# EAGLE design ranback_bottom (EAGLE 9.6.2)
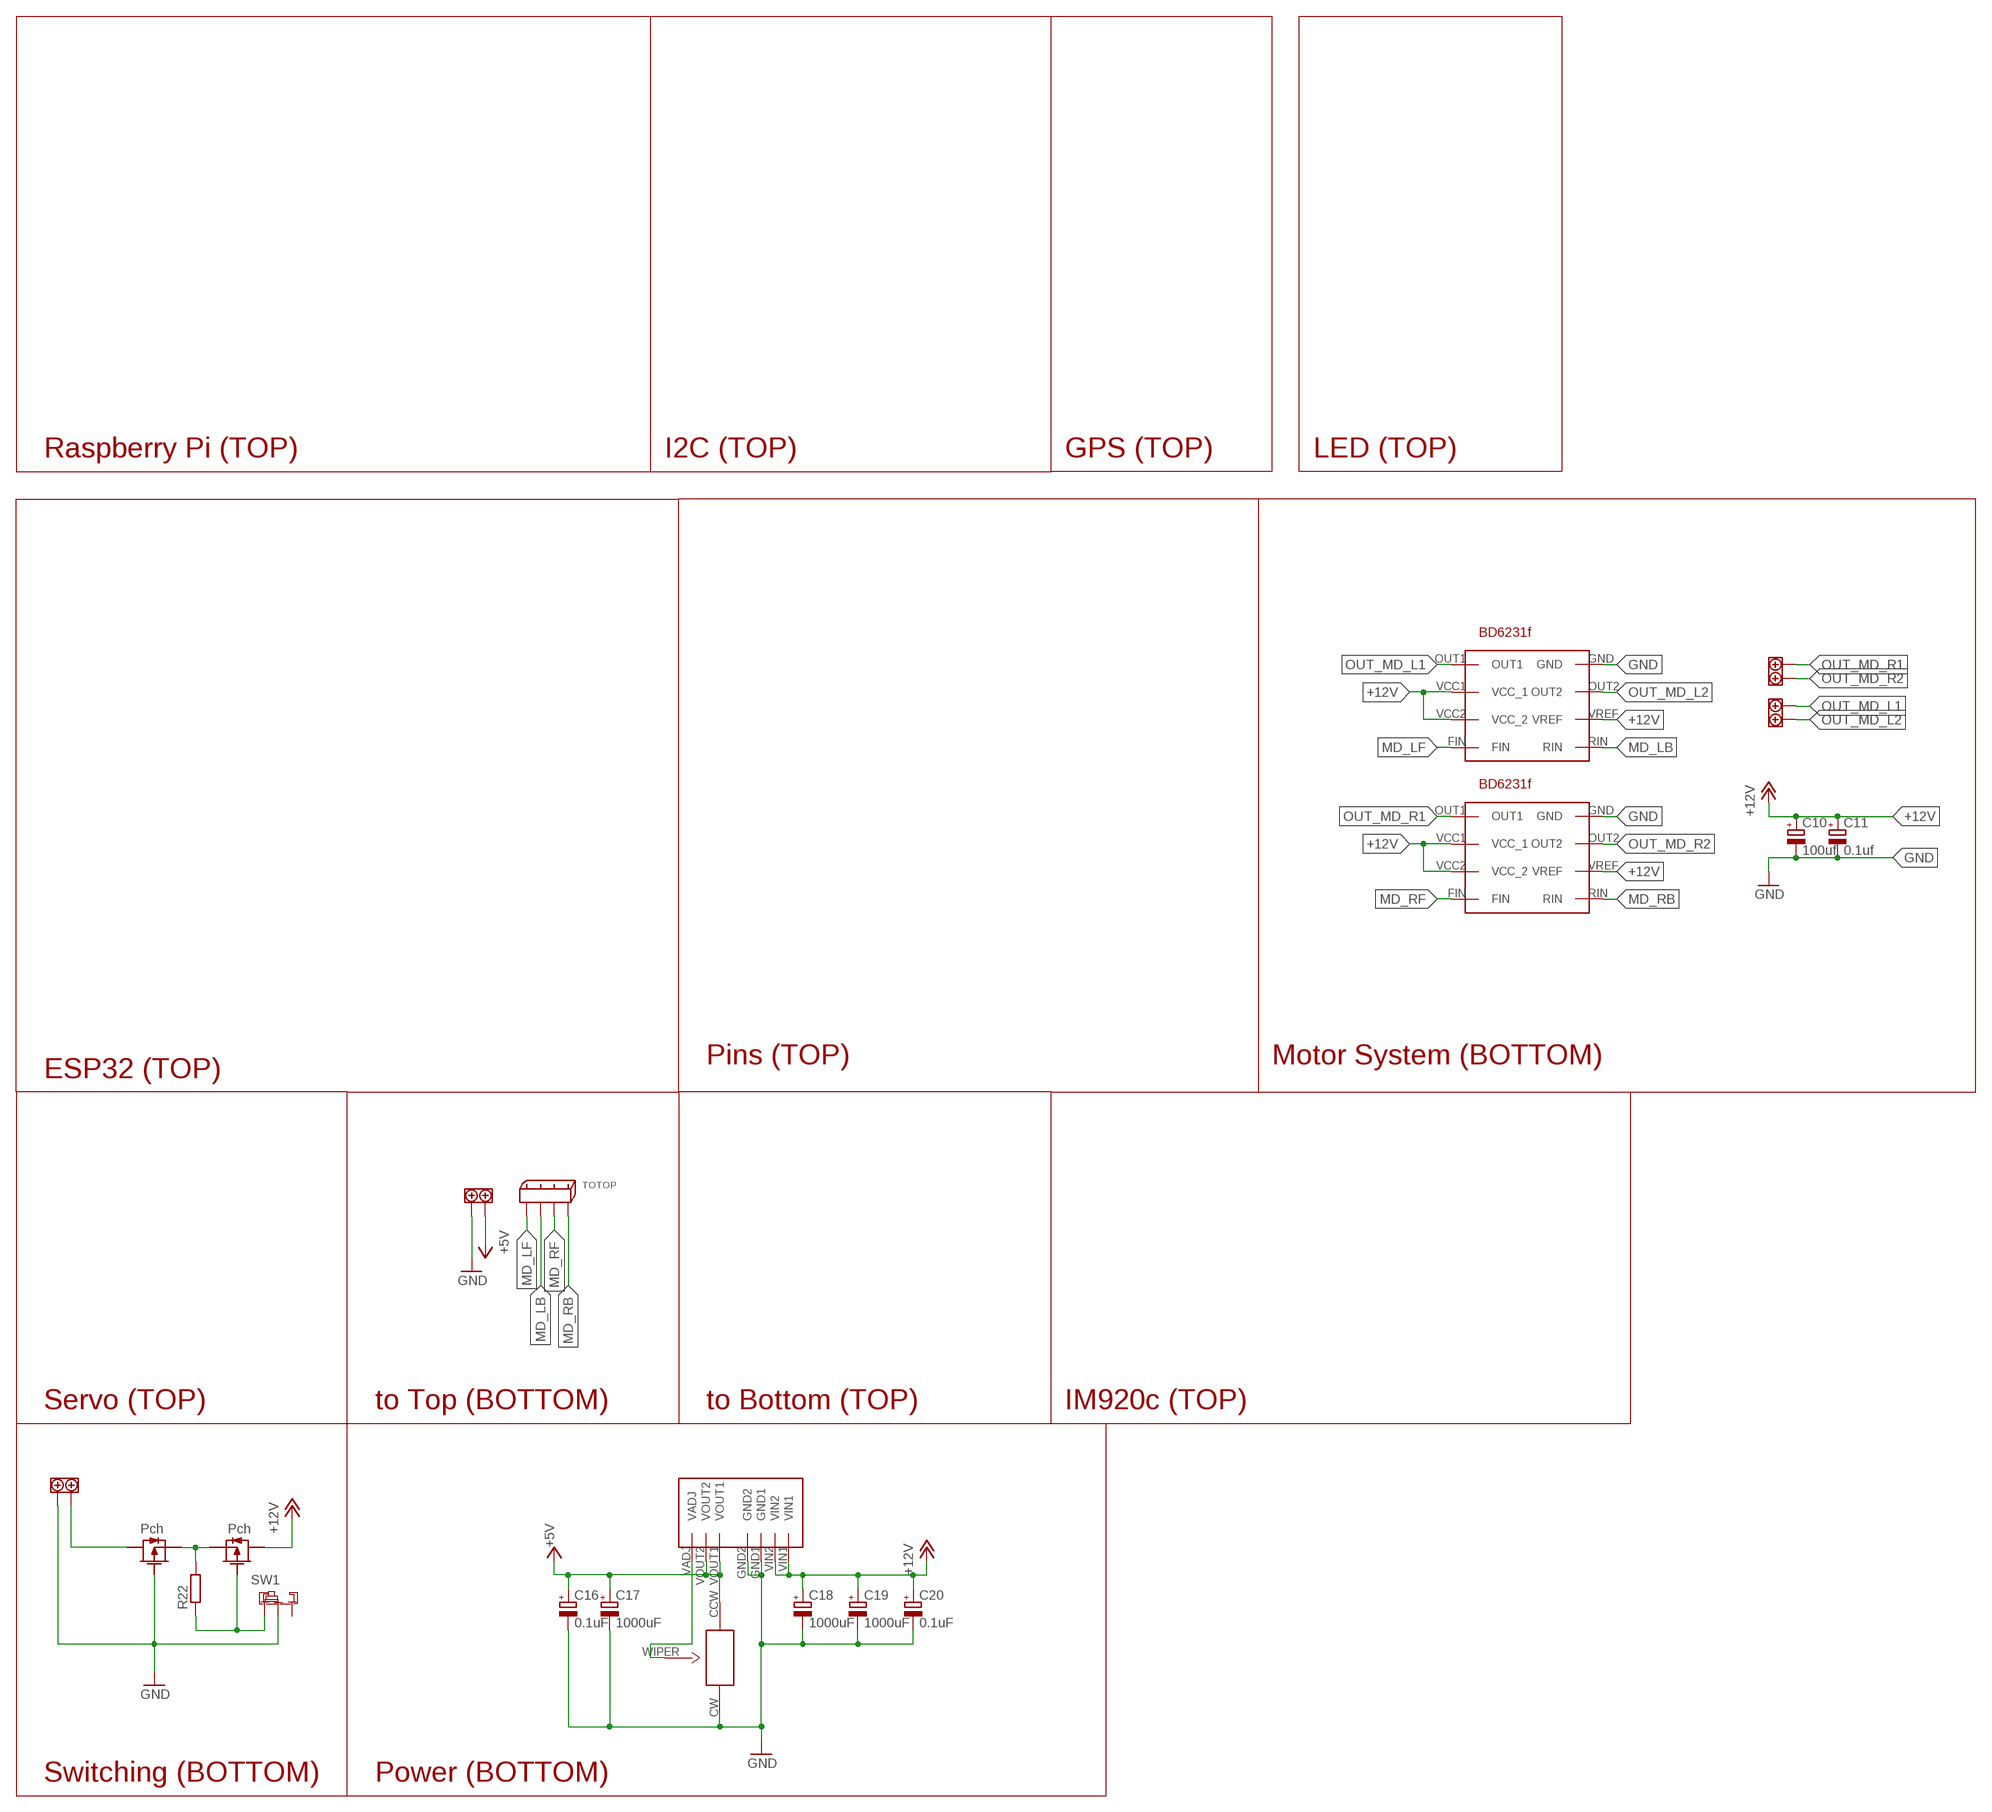
[diagram p0: schematic, sheet 1]

## Parts
100KR1  100kR  3362P  [3362P]
C10  100uf  CPOL-EUE2.5-7  [E2,5-7]
C11  0.1uf  CPOL-EUE2.5-7  [E2,5-7]
C16  0.1uF  CPOL-EUE2.5-7  [E2,5-7]
C17  1000uF  CPOL-EUE5-10.5  [E5-10,5]
C18  1000uF  CPOL-EUE5-10.5  [E5-10,5]
C19  1000uF  CPOL-EUE5-10.5  [E5-10,5]
C20  0.1uF  CPOL-EUE2.5-7  [E2,5-7]
MD_L  BD6231F  [BD6231F]
MD_R  BD6231F  [BD6231F]
R22  R-EU_0207/10  [0207/10]
SW1  SRIDE_SWITCH  [SRIDE_SWITCH]
TM1  TERMINAL_SLOPED_2PIN  [TERMINAL_SLOPED_2PIN]
TM2  TERMINAL_SLOPED_2PIN  [TERMINAL_SLOPED_2PIN]
TM3  TERMINAL_SLOPED_2PIN  [TERMINAL_SLOPED_2PIN]
TM4  TERMINAL_SLOPED_2PIN  [TERMINAL_SLOPED_2PIN]
TOTOP  2.5_MINI-SPOX_4PIN  [2.5_MINI-SPOX_4PIN]
U$7  2SJ681-PCH  [2SJ681]
U$8  5V3A_KIC-053  [5V3A_KIC-053]
U$10  2SJ681-PCH  [2SJ681]

## Nets
+5V: 100KR1.CCW C16.+ C17.+ TM4.1 U$8.VOUT1 U$8.VOUT2
+12V: C10.+ C11.+ C18.+ C19.+ C20.+ MD_L.VCC1(VCC_1) MD_L.VCC2(VCC_2) MD_L.VREF MD_R.VCC1(VCC_1) MD_R.VCC2(VCC_2) MD_R.VREF U$8.VIN1 U$8.VIN2 U$10.DRAIN
A7_1: R22.2 U$7.SOURCE U$10.SOURCE
GND [GND_+12V]: 100KR1.CW C10.- C11.- C16.- C17.- C18.- C19.- C20.- MD_L.GND MD_R.GND SW1.LR TM3.2 TM4.2 U$7.GATE U$8.GND1 U$8.GND2
MD_LB: MD_L.RIN TOTOP.P$2
MD_LF: MD_L.FIN TOTOP.P$1
MD_RB: MD_R.RIN TOTOP.P$4
MD_RF: MD_R.FIN TOTOP.P$3
N$9: TM3.1 U$7.DRAIN
N$18: 100KR1.WIPER U$8.VADJ
N$20: R22.1 SW1.L U$10.GATE
OUT_MD_L1 [GND_+12V]: MD_L.OUT1 TM2.1
OUT_MD_L2 [GND_+12V]: MD_L.OUT2 TM2.2
OUT_MD_R1 [GND_+12V]: MD_R.OUT1 TM1.1
OUT_MD_R2 [GND_+12V]: MD_R.OUT2 TM1.2
Unconnected: SW1.R

## Notes on the sheet
- Raspberry Pi (TOP) | I2C (TOP) | GPS (TOP) | LED (TOP)
- Pins (TOP) | Motor System (BOTTOM)
- ESP32 (TOP)
- Servo (TOP) | to Top (BOTTOM) | to Bottom (TOP) | IM920c (TOP)
- Switching (BOTTOM) | Power (BOTTOM)

## Library data of the parts
100KR1 = TRIM_register:3362P
C10 C11 C16-C20 = rcl:CPOL-EU: POLARIZED CAPACITOR, European symbol; SPICEPREFIX: C
MD_L MD_R = Motor Driver:BD6231F
R22 = rcl:R-EU_: RESISTOR, European symbol; SPICEPREFIX: R
SW1 = Switches:SRIDE_SWITCH
TM1-TM4 = TerminalBrock:TERMINAL_SLOPED_2PIN
TOTOP = Connector:2.5_MINI-SPOX_4PIN
U$7 U$10 = mosfet:2SJ681-PCH
U$8 = DC-DC:5V3A_KIC-053

## Net classes
1 esp: width 0.254 mm, drill 0.127 mm, clearance 0.025 mm
2 GND_+12V: width 0.152 mm

## Board
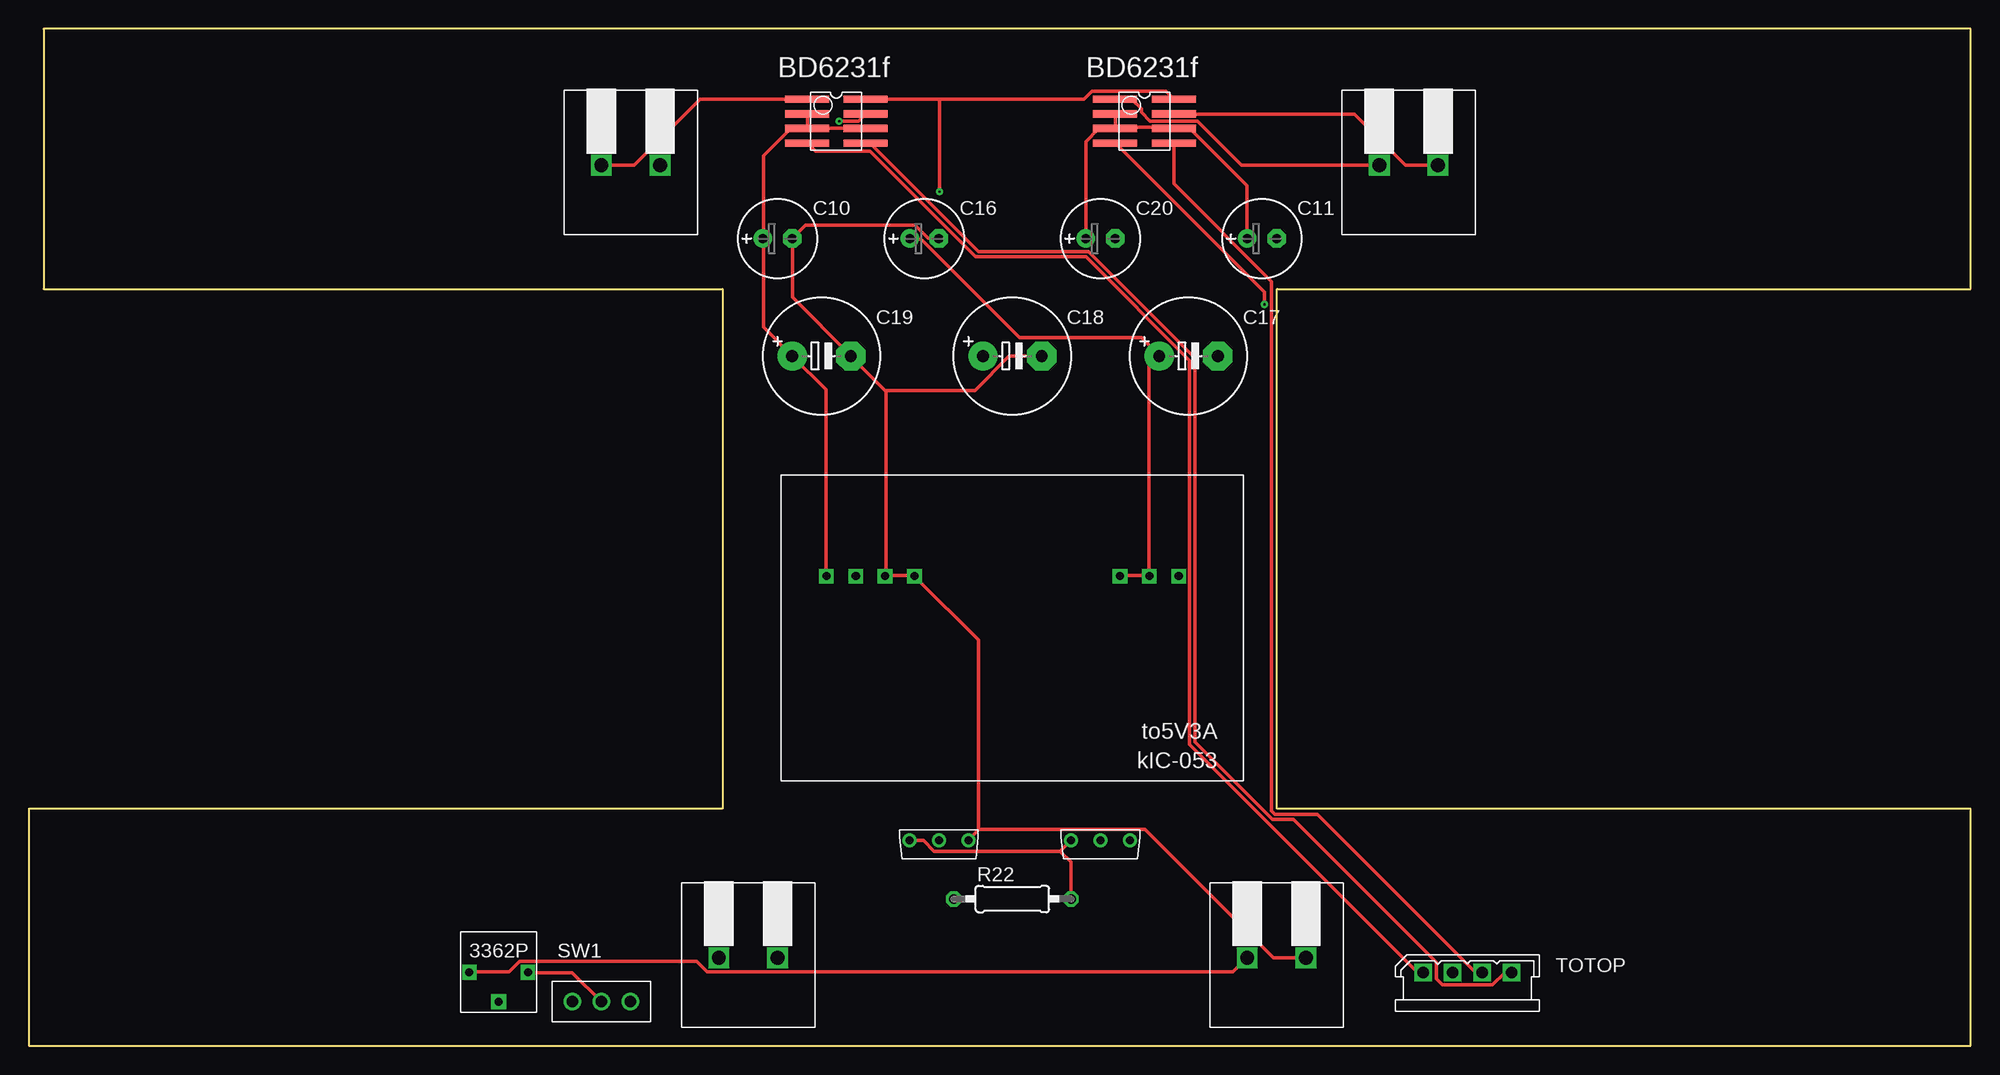
[diagram p1: board, top side]
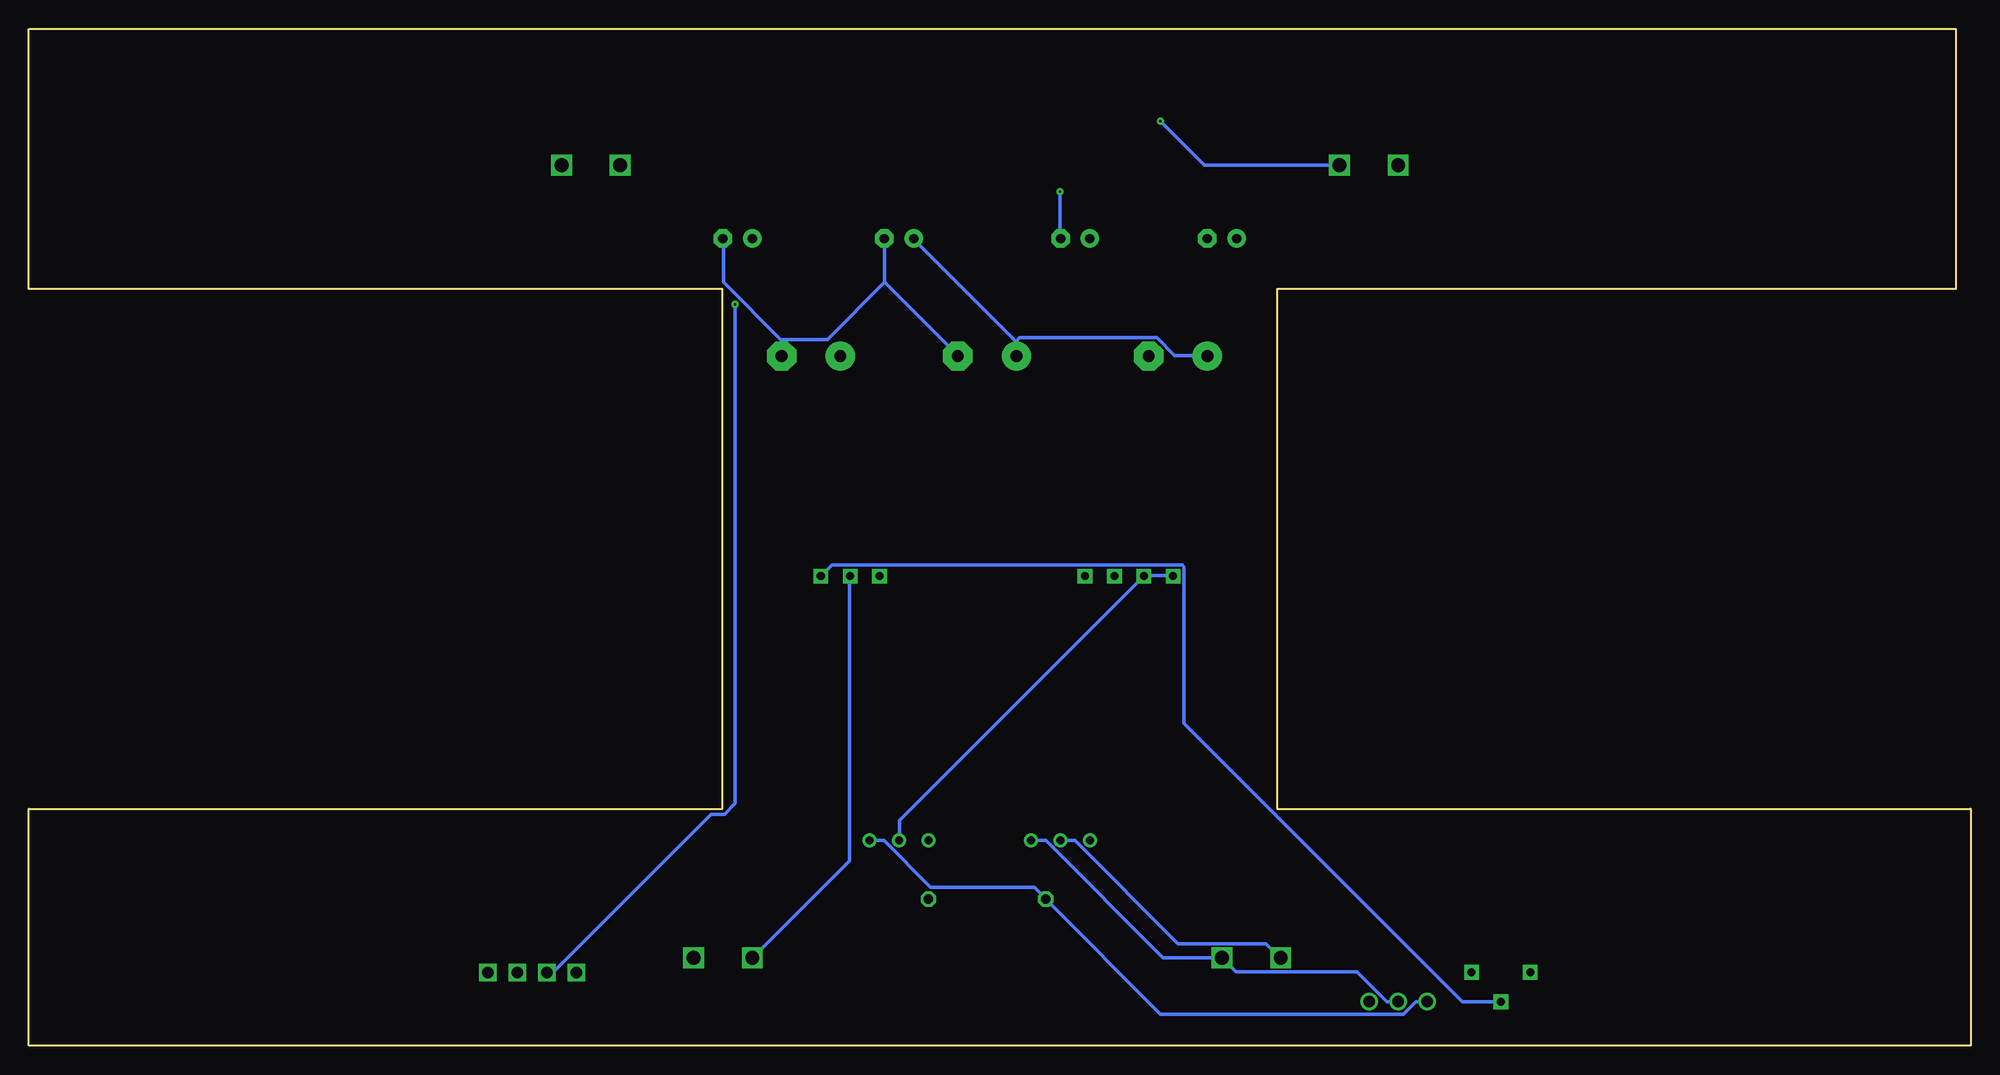
[diagram p2: board, bottom side, seen from below]

Size 168 x 88 mm. Coordinates in mm from the lower left corner, seen from the top.
Outline: 0,0 168,0 168,20.5 108,20.5 108,65.5 168,65.5 168,88 1.27,88 1.27,65.5 60,65.5 60,20.5 0,20.5 0,0
Copper layers (1*16): Top 0.035mm / dielectric 1.5mm / Bottom 0.035mm
Design rules "PCBGoGo": minimum track width 6mil, minimum drill 0.2mm, track to track 6mil, track to pad 6mil, pad to pad 6mil, via to via 6mil, smd to smd 6mil, copper to edge 0.2mm, drill to drill 6mil, minimum pad ring 10mil, minimum via ring 8mil, stop-mask expansion 4mil, vias tented up to drill 0mil, thermal gap 10mil

### Footprints (pad centres in the part's own frame; a part is rotated, then mirrored left to right if it is on the bottom)
3362P = drill 0.7 pad 1.27 square: CCW -2.54,2.54; CW 2.54,2.54; WIPER 0,0
E2,5-7 = drill 0.813 pad 1.6: + -1.27,0 | drill 0.813 pad 1.6 octagon: - 1.27,0
E5-10,5 = drill 1.016 pad 2.54: + -2.54,0 | drill 1.016 pad 2.54 octagon: - 2.54,0
BD6231F = smd 3.81 x 0.635: FIN -2.54,-1.905; GND 2.54,1.905; OUT1 -2.54,1.905; OUT2 2.54,0.635; RIN 2.54,-1.905; VCC1 -2.54,0.635; VCC2 -2.54,-0.635; VREF 2.54,-0.635
0207/10 = drill 0.813 octagon: 1 -5.08,0; 2 5.08,0
SRIDE_SWITCH = drill 1: L -2.5,0; LR 0,0; R 2.5,0
TERMINAL_SLOPED_2PIN = drill 1.2 square: 1 -2.54,0; 2 2.54,0
2.5_MINI-SPOX_4PIN = drill 1 square: P$1 -1.27,0; P$2 6.35,0; P$3 1.27,0; P$4 3.81,0
2SJ681 = drill 0.7: DRAIN 0,0; GATE 2.54,0; SOURCE -2.54,0
5V3A_KIC-053 = drill 0.7 pad 1.27 square: GND1 11.01,0; GND2 8.47,0; VADJ -14.39,0; VIN1 16.09,0; VIN2 13.55,0; VOUT1 -9.31,0; VOUT2 -11.85,0

### Placement (x,y rotation side)
100KR1  40.64,3.81 0 top
C10  64.77,69.85 0 top
C11  106.68,69.85 0 top
C16  77.47,69.85 0 top
C17  100.33,59.69 0 top
C18  85.09,59.69 0 top
C19  68.58,59.69 0 top
C20  92.71,69.85 0 top
MD_L  69.85,80.01 0 top
MD_R  96.52,80.01 0 top
R22  85.09,12.7 0 top
SW1  49.53,3.81 0 top
TM1  119.38,76.2 0 top
TM2  52.07,76.2 0 top
TM3  62.23,7.62 0 top
TM4  107.95,7.62 0 top
TOTOP  121.92,6.35 0 top
U$7  78.74,17.78 0 top
U$8  85.09,40.64 180 top
U$10  92.71,17.78 0 top

### Tracks (layer width: path | path; a pad name or v marks a point on that pad's centre or on a via)
+5V
  Top 0.305: U$8.VOUT1 94.41,40.69 96.93,40.69 U$8.VOUT2 96.93,40.84 96.93,58.83 C17.+ 97.77,59.74 96.24,61.27 85.72,61.27 77.19,69.8 76.2,69.8 C16.+ | 100KR1.CCW 38.1,6.4 41.53,6.4 42.44,7.32 57.76,7.32 58.67,6.4 104.17,6.4 105.39,7.62 TM4.1
  Bottom 0.305: U$8.VOUT2 97,40.62 97,16 105.39,7.62 TM4.1
+12V
  Top 0.305: MD_L.VCC2 67.36,79.4 67.36,80.62 MD_L.VCC1 | MD_L.VREF 72.39,79.4 67.51,79.4 MD_L.VCC2 | MD_L.VCC2 67.21,79.32 65.84,79.32 63.55,77.04 63.55,69.95 C10.+ 63.55,69.8 63.55,62.18 C19.+ 68.96,56.77 68.96,40.69 U$8.VIN1 | C11.+ 105.39,69.88 105.39,74.45 100.51,79.32 99.06,79.32 MD_R.VREF 98.98,79.48 94.18,79.48 MD_R.VCC2 | C20.+ 91.44,78.26 92.51,79.32 93.95,79.32 MD_R.VCC2 | MD_R.VCC1 94.03,80.62 94.03,79.48 MD_R.VCC2
  Bottom 0.305: U$10.DRAIN 92.66,17.83 92.66,19.51 71.55,40.62 U$8.VIN2 71.4,40.69 69.04,40.69 U$8.VIN1 | 82.6,60.96 82.6,59.74 C18.+ | 82.6,60.96 91.44,69.8 C20.+ | 82.6,60.96 82.3,61.27 70.41,61.27 68.89,59.74 66.06,59.74 C19.+
A7_1
  Top 0.305: 89.23,16.84 78.33,16.84 77.42,17.75 76.2,17.75 U$7.SOURCE | U$10.SOURCE 89.23,16.84 | 89.23,16.84 90.14,15.93 90.14,12.72 R22.2
GND  (via drill 0.2)
  Top 0.305: SW1.LR 47.02,6.33 43.2,6.33 100KR1.CW | TM4.2 107.67,7.62 96.55,18.75 82.22,18.75 | 82.22,18.75 81.31,17.83 U$7.GATE | 78.79,81.92 91.29,81.92 91.97,82.6 98.37,82.6 MD_R.GND | 78.79,81.92 MD_L.GND | C16.- 78.72,69.88 77.8,69.88 76.66,71.02 67.21,71.02 C10.- 66.06,69.8 66.06,64.77 71.09,59.74 C19.- 71.17,59.59 74.14,56.62 | 74.14,56.62 74.14,40.84 U$8.GND1 74.14,40.69 76.58,40.69 U$8.GND2 76.73,40.54 82.14,35.13 82.14,18.82 82.22,18.75 | v78.79,73.91 78.79,81.92 | C18.- 87.63,59.66 84.81,59.66 81.84,56.69 74.22,56.69 74.14,56.62
  Bottom 0.305: U$7.GATE 81.23,17.75 80.01,17.75 69.88,7.62 TM3.2 63.55,6.4 53.11,6.4 50.52,3.81 SW1.LR | 102.87,61.04 107.9,66.06 107.9,69.8 C11.- | C17.- 102.87,61.04 | 93.95,66.06 93.95,69.8 C20.- | 93.95,66.06 87.63,59.74 C18.- | 93.95,66.06 98.91,61.11 102.79,61.11 102.87,61.04 | v78.79,73.91 78.79,69.88 C16.-
MD_LB
  Top 0.305: MD_L.RIN 72.77,78.11 82.14,68.73 91.67,68.73 100.89,59.51 100.89,26.29 107.59,19.58 109.42,19.58 121.77,7.24 121.77,5.79 122.3,5.26 126.64,5.26 127.71,6.33 128.25,6.33 TOTOP.P$2
MD_LF
  Top 0.305: TOTOP.P$1 120.62,6.4 120.09,6.4 100.43,26.06 100.43,59.28 91.44,68.28 81.92,68.28 72.77,77.42 68.05,77.42 67.36,78.11 MD_L.FIN
MD_RB
  Top 0.305: MD_R.RIN 99.06,74.6 107.52,66.14 107.52,20.34 107.82,20.04 111.48,20.04 125.12,6.4 125.73,6.4 TOTOP.P$4
MD_RF  (via drill 0.2)
  Top 0.305: v106.91,64.16 106.91,65.23 94.03,78.11 MD_R.FIN
  Bottom 0.305: v106.91,64.16 106.91,20.95 107.82,20.04 108.97,20.04 122.61,6.4 123.14,6.4 TOTOP.P$3
N$9
  Bottom 0.305: U$7.DRAIN 78.72,17.75 77.5,17.75 68.58,8.84 60.96,8.84 59.74,7.62 TM3.1
N$18
  Bottom 0.305: 100KR1.WIPER 43.97,3.81 68.05,27.89 68.05,41.45 68.2,41.6 98.53,41.6 99.44,40.69 U$8.VADJ
N$20
  Bottom 0.305: U$10.GATE 95.25,17.75 94.03,17.75 89.99,13.72 81,13.72 80.01,12.72 R22.1 79.93,12.57 70.1,2.74 49.07,2.74 48.01,3.81 SW1.L
OUT_MD_L1
  Top 0.305: TM2.1 52.35,76.2 58.06,81.92 MD_L.OUT1
OUT_MD_L2  (via drill 0.2)
  Top 0.305: v70.1,80.01 71.78,80.01 72.39,80.62 MD_L.OUT2
  Bottom 0.305: TM2.2 66.29,76.2 v70.1,80.01
OUT_MD_R1
  Top 0.305: TM1.1 104.93,76.2 101.12,80.01 97,80.01 96.24,80.77 96.24,81.08 95.4,81.92 MD_R.OUT1
OUT_MD_R2
  Top 0.305: TM1.2 119.1,76.2 114.68,80.62 99.06,80.62 MD_R.OUT2